# Altium schematic sheet MB1455_Top.SchDoc: Top hierarchical view
size A4; Date: Not used; ApprovedBy: Not used; CheckedBy: Not used; Author: Not used; CompanyName: STMicroelectronics; DrawnBy: Not used; Engineer: Not used; Organization: Not used; Address1: Not used; Address2: Not used; Address3: Not used; Address4: Not used; DocumentNumber: Not used; Revision: A-01-P3; SheetNumber: 2; SheetTotal: 6; CurrentTime: Not used; CurrentDate: Not used; Time: Not used; DocumentFullPathAndName: Not used; DocumentName: Not used; ModifiedDate: Not used; ImagePath: Not used; ProjectName: Not used; Application_BuildNumber: Not used
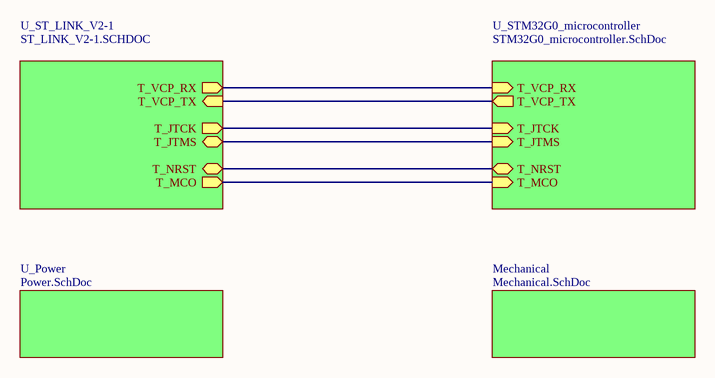
[diagram p0: MB1455_Top.SchDoc]

## Sub-sheets
Mechanical = Mechanical.SchDoc: no entries
U_Power = Power.SchDoc: no entries
U_ST_LINK_V2-1 = ST_LINK_V2-1.SCHDOC: T_VCP_RX (out), T_VCP_TX (in), T_JTMS (bidir), T_JTCK (out), T_NRST (bidir), T_MCO (out)
U_STM32G0_microcontroller = STM32G0_microcontroller.SchDoc: T_NRST (bidir), T_JTCK (in), T_JTMS (in), T_VCP_RX (in), T_VCP_TX (out), T_MCO (in)

## Nets
(unnamed): sheet U_ST_LINK_V2-1/T_VCP_RX, sheet U_STM32G0_microcontroller/T_VCP_RX
(unnamed): sheet U_ST_LINK_V2-1/T_VCP_TX, sheet U_STM32G0_microcontroller/T_VCP_TX
(unnamed): sheet U_ST_LINK_V2-1/T_JTMS, sheet U_STM32G0_microcontroller/T_JTMS
(unnamed): sheet U_ST_LINK_V2-1/T_JTCK, sheet U_STM32G0_microcontroller/T_JTCK
(unnamed): sheet U_ST_LINK_V2-1/T_NRST, sheet U_STM32G0_microcontroller/T_NRST
(unnamed): sheet U_ST_LINK_V2-1/T_MCO, sheet U_STM32G0_microcontroller/T_MCO

## Notes on the sheet
- Title:
- Project:
- Size:
- Revision:
- Variant:
- A4
- -
- Date:
- Reference:
- Sheet:
- of